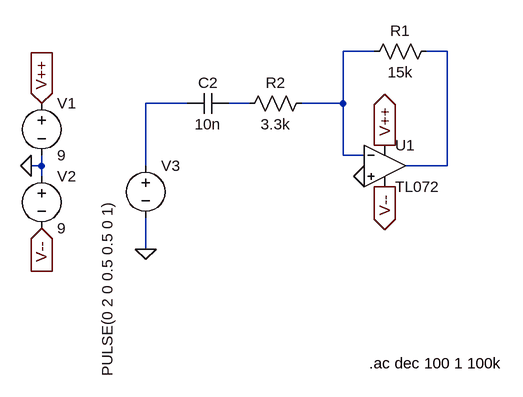
[diagram p0: schematic HighPassFirstOrder.asc]
HighPassFirstOrder.asc, the LTspice schematic file:
Version 4
SHEET 1 880 680
WIRE 608 128 560 128
WIRE 720 128 688 128
WIRE 320 208 256 208
WIRE 416 208 384 208
WIRE 560 208 560 128
WIRE 560 208 496 208
WIRE 560 288 560 208
WIRE 592 288 560 288
WIRE 96 304 96 288
WIRE 96 304 80 304
WIRE 256 304 256 208
WIRE 720 304 720 128
WIRE 720 304 656 304
WIRE 96 320 96 304
WIRE 256 432 256 384
FLAG 80 304 0
FLAG 96 208 V++
IOPIN 96 208 In
FLAG 96 400 V--
IOPIN 96 400 In
FLAG 256 432 0
FLAG 624 336 V--
IOPIN 624 336 Out
FLAG 624 272 V++
IOPIN 624 272 Out
FLAG 592 320 0
SYMBOL Voltage 96 192 R0
SYMATTR InstName V1
SYMATTR Value 9
SYMBOL Voltage 96 304 R0
SYMATTR InstName V2
SYMATTR Value 9
SYMBOL Voltage 256 288 R0
WINDOW 3 -59 70 VRight 2
SYMATTR Value PULSE(0 2 0 0.5 0.5 0 1)
SYMATTR InstName V3
SYMATTR Value2 AC 1
SYMBOL OpAmps/TL072 624 240 R0
SYMATTR InstName U1
SYMBOL Res 704 112 R90
WINDOW 0 0 56 VBottom 2
WINDOW 3 32 56 VTop 2
SYMATTR InstName R1
SYMATTR Value 15k
SYMBOL Res 512 192 R90
WINDOW 0 0 56 VBottom 2
WINDOW 3 32 56 VTop 2
SYMATTR InstName R2
SYMATTR Value 3.3k
SYMBOL Cap 384 192 R90
WINDOW 0 0 32 VBottom 2
WINDOW 3 32 32 VTop 2
SYMATTR InstName C2
SYMATTR Value 10n
TEXT 600 608 Left 2 !.ac dec 100 1 100k

The netlist it stands for:
* HighPassFirstOrder.asc
V1 V++ 0 9
V2 0 V-- 9
V3 N003 0 PULSE(0 2 0 0.5 0.5 0 1) AC 1
XU1 0 N001 V++ V-- N002 TL072  ; pins In+ In- V+ V- OUT
R1 N002 N001 15k
R2 N001 N004 3.3k
C2 N004 N003 10n
.ac dec 100 1 100k
.backanno
.end